# EAGLE design balise émettrice (EAGLE 6.3)
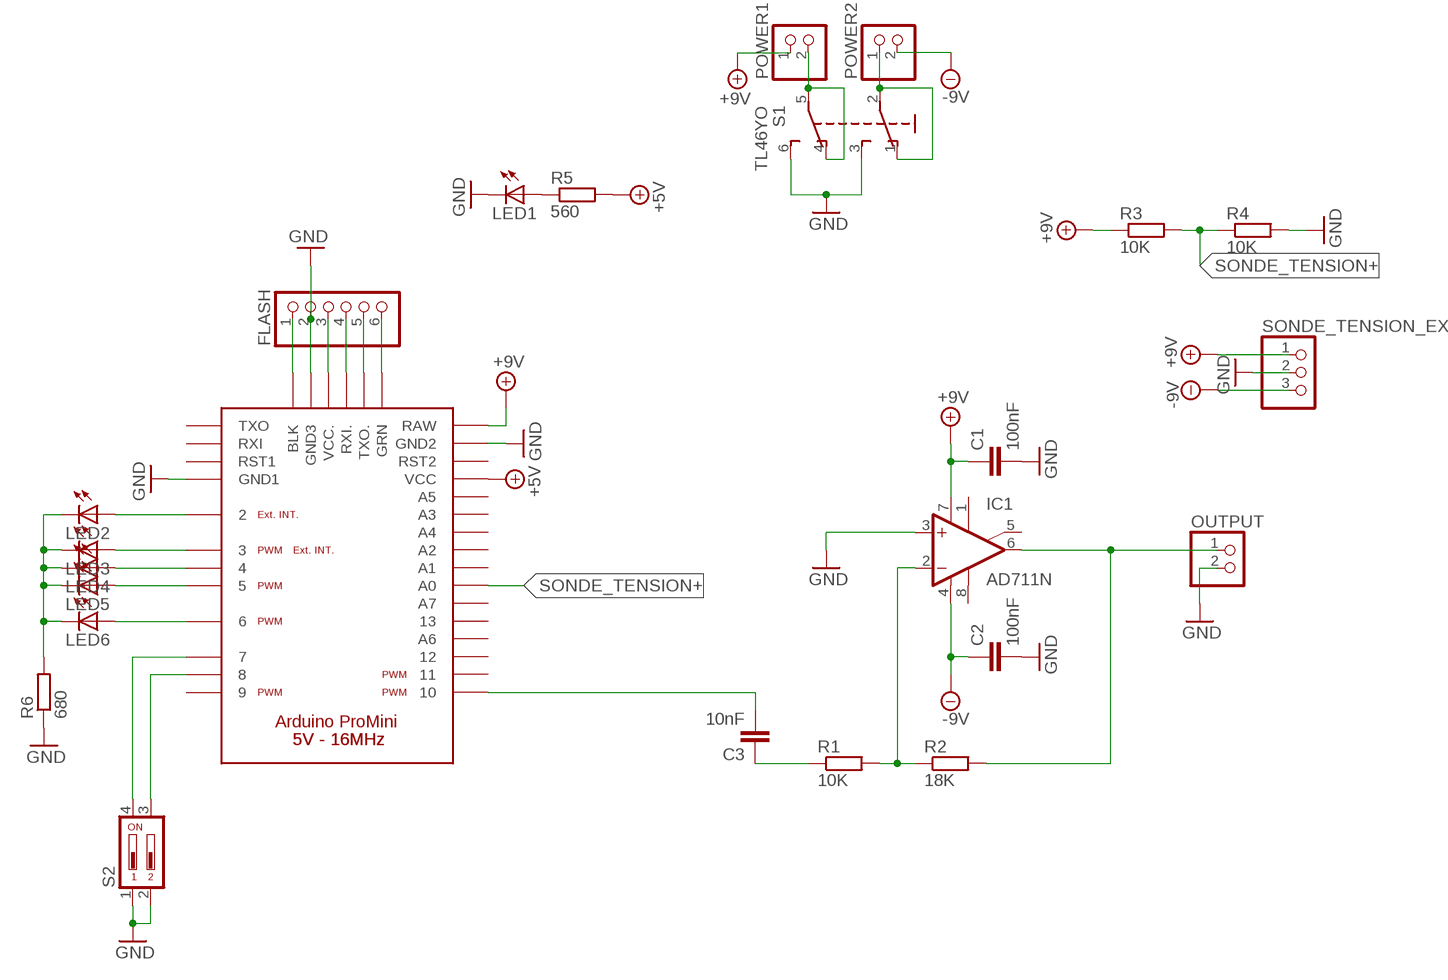
[diagram p0: schematic, sheet 1]

## Parts
C1  100nF  C-EU050-024X044  [C050-024X044]
C2  100nF  C-EU050-024X044  [C050-024X044]
C3  10nF  C-EU050-024X044  [C050-024X044]
FLASH  PINHD-1X6/90  [1X06/90]
IC1  AD711N  [DIL08]
LED1  LEDB155  [Q62902-B155]
LED2  LED3MM  [LED3MM]
LED3  LED3MM  [LED3MM]
LED4  LED3MM  [LED3MM]
LED5  LED3MM  [LED3MM]
LED6  LED3MM  [LED3MM]
OUTPUT  PINHD-1X2  [1X02]
POWER1  PINHD-1X2  [1X02]
POWER2  PINHD-1X2  [1X02]
R1  10K  R-EU_0204/7  [0204/7]
R2  18K  R-EU_0204/7  [0204/7]
R3  10K  R-EU_0204/7  [0204/7]
R4  10K  R-EU_0204/7  [0204/7]
R5  560  R-EU_0207/12  [0207/12]
R6  680  R-EU_0204/7  [0204/7]
S1  TL46YO  [TL4XYO]
S2  DA02  [DA-02]
SONDE_TENSION_EXT  PINHD-1X3  [1X03]
U$1  ARDUINO_PRO_MINI  [ARDUINO_PRO_MINI]

## Nets
+5V: R5.2 U$1.VCC1(VCC)
+9V: C1.1 IC1.7(V+) POWER1.1 R3.1 SONDE_TENSION_EXT.1 U$1.RAW
-9V: C2.1 IC1.4(V-) POWER2.2 SONDE_TENSION_EXT.3
GND: C1.2 C2.2 FLASH.2 IC1.3(+IN) LED1.K(C) OUTPUT.2 R4.2 R6.1 S1.3(S) S1.6(S1) S2.1 S2.2 SONDE_TENSION_EXT.2 U$1.GND1 U$1.GND2 U$1.GND3
N$1: FLASH.1 U$1.BLK
N$2: IC1.6(OUT) OUTPUT.1 R2.2
N$3: IC1.2(-IN) R1.2 R2.1
N$4: LED1.A R5.1
N$5: FLASH.3 U$1.VCC2(VCC.)
N$6: FLASH.4 U$1.RXI2(RXI.)
N$7: FLASH.5 U$1.TXO2(TXO.)
N$8: FLASH.6 U$1.GRN
N$9: C3.1 R1.1
N$10: LED2.A U$1.2
N$11: LED3.A U$1.3
N$12: LED4.A U$1.4
N$13: LED5.A U$1.5
N$14: LED6.A U$1.6
N$15: LED2.K(C) LED3.K(C) LED4.K(C) LED5.K(C) LED6.K(C) R6.2
N$16: POWER1.2 S1.4(O1) S1.5(P1)
N$17: POWER2.1 S1.1(O) S1.2(P)
N$20: S2.4 U$1.7
N$21: S2.3 U$1.8
N$22: C3.2 U$1.10
SONDE_TENSION+: R3.2 R4.1 U$1.A0
Unconnected: IC1.1(ON1) IC1.5(ON2) IC1.8(OPT) U$1.9 U$1.11 U$1.12 U$1.13 U$1.A1 U$1.A2 U$1.A3 U$1.A4 U$1.A5 U$1.A6 U$1.A7 U$1.RST1 U$1.RST2 U$1.RXI1(RXI) U$1.TXO1(TXO)

## Library data of the parts
C1-C3 = resistor:C-EU: CAPACITOR, European symbol
FLASH = pinhead:PINHD-1X6: PIN HEADER
IC1 = linear:AD711: OP AMP
LED1-LED6 = led:LED: LED OSRAM: - CHIPLED LG R971, LG N971, LY N971, LG Q971, LY Q971, LO R971, LY R971 LH N974, LH R974 LS Q976, LO Q976, LY Q976 LO Q996 - Hyper CHIPLED LW Q18S LB Q993, LB Q99A, LB R99A - SideLED LS A670, LO A670, LY A670, LG A670, LP A670 LB A673, LV A673, LT A673, LW A673 LH A674 LY A675 LS A676, LA A676, LO A676, LY A676, LW A676 LS A679, LY A679, LG A679 - Hyper Micro SIDELED® LS Y876, LA Y876, LO Y876, LY Y876 LT Y87S - SmartLED LW L88C, LW L88S LB L89C, LB L89S, LG L890 LS L89K, LO L89K, LY L89K LS L896, LA L896, LO L896, LY L896 - TOPLED LS T670, LO T670, LY T670, LG T670, LP T670 LSG T670, LSP T670, LSY T670, LOP T670, LYG T670 LG T671, LOG T671, LSG T671 LB T673, LV T673, LT T673, LW T673 LH T674 LS T676, LA T676, LO T676, LY T676, LB T676, LH T676, LSB T676, LW T676 LB T67C, LV T67C, LT T67C, LS T67K, LO T67K, LY T67K, LW E67C LS E67B, LA E67B, LO E67B, LY E67B, LB E67C, LV E67C, LT E67C LW T67C LS T679, LY T679, LG T679 LS T770, LO T770, LY T770, LG T770, LP T770 LB T773, LV T773, LT T773, LW T773 LH T774 LS E675, LA E675, LY E675, LS T675 LS T776, LA T776, LO T776, LY T776, LB T776 LHGB T686 LT T68C, LB T68C - Hyper Mini TOPLED® LB M676 - Mini TOPLED Santana® LG M470 LS M47K, LO M47K, LY M47K Source: http://www.osram.convergy.de LUXEON: - LUMILED® LXK2-PW12-R00, LXK2-PW12-S00, LXK2-PW14-U00, LXK2-PW14-V00 LXK2-PM12-R00, LXK2-PM12-S00, LXK2-PM14-U00 LXK2-PE12-Q00, LXK2-PE12-R00, LXK2-PE12-S00, LXK2-PE14-T00, LXK2-PE14-U00 LXK2-PB12-K00, LXK2-PB12-L00, LXK2-PB12-M00, LXK2-PB14-N00, LXK2-PB14-P00, LXK2-PB14-Q00 LXK2-PR12-L00, LXK2-PR12-M00, LXK2-PR14-Q00, LXK2-PR14-R00 LXK2-PD12-Q00, LXK2-PD12-R00, LXK2-PD12-S00 LXK2-PH12-R00, LXK2-PH12-S00 LXK2-PL12-P00, LXK2-PL12-Q00, LXK2-PL12-R00 Source: www.luxeon.com KINGBRIGHT: KA-3528ASYC Source: www.kingbright.com
OUTPUT POWER1 POWER2 = pinhead:PINHD-1X2: PIN HEADER
R1-R6 = resistor:R-EU_: RESISTOR, European symbol
S1 = switch:TL46YO: TINY SWITCH ON - ON Source: http://www2.produktinfo.conrad.com/datenblaetter/700000-724999/705152-da-01-de-Subminiaturschalter_TL_36YO.pdf
S2 = switch-dil:DA02: DIL/CODE SWITCH; OC_FARNELL: 1255229; OC_NEWARK: unknown
SONDE_TENSION_EXT = pinhead:PINHD-1X3: PIN HEADER
U$1 = arduino:ARDUINO_PRO_MINI

## Board
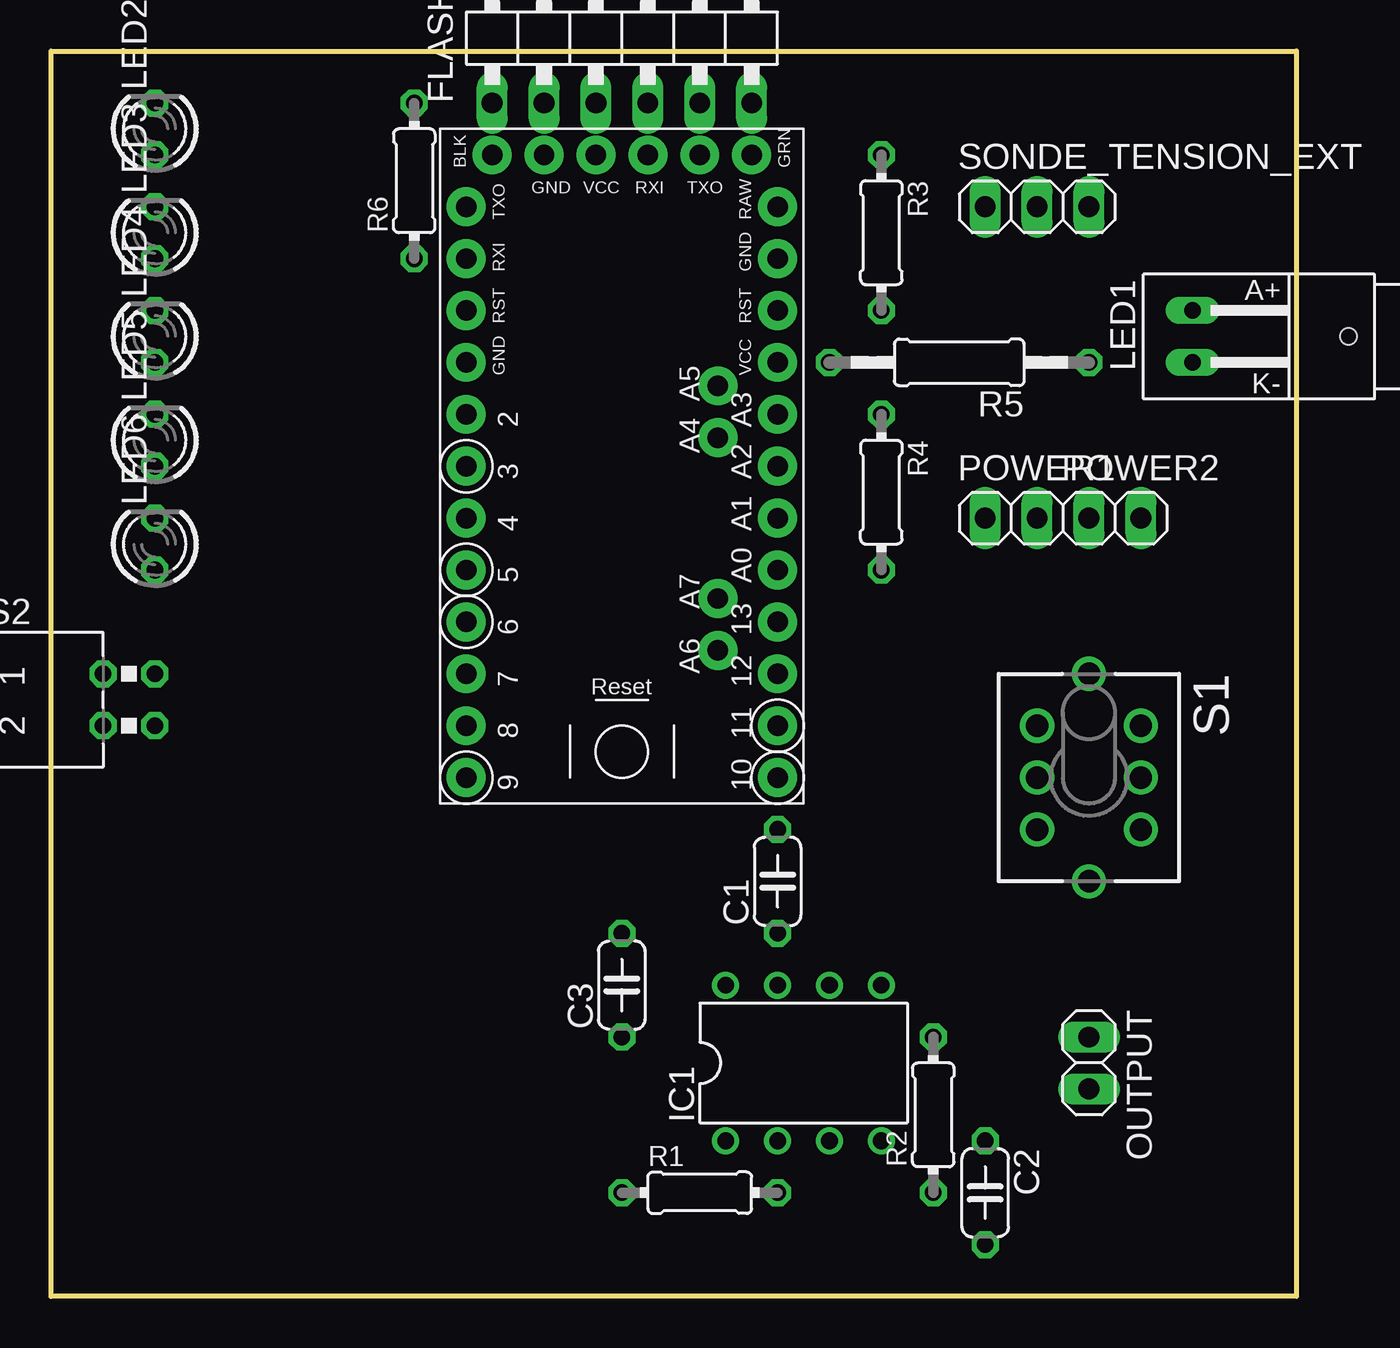
[diagram p1: board, top side]
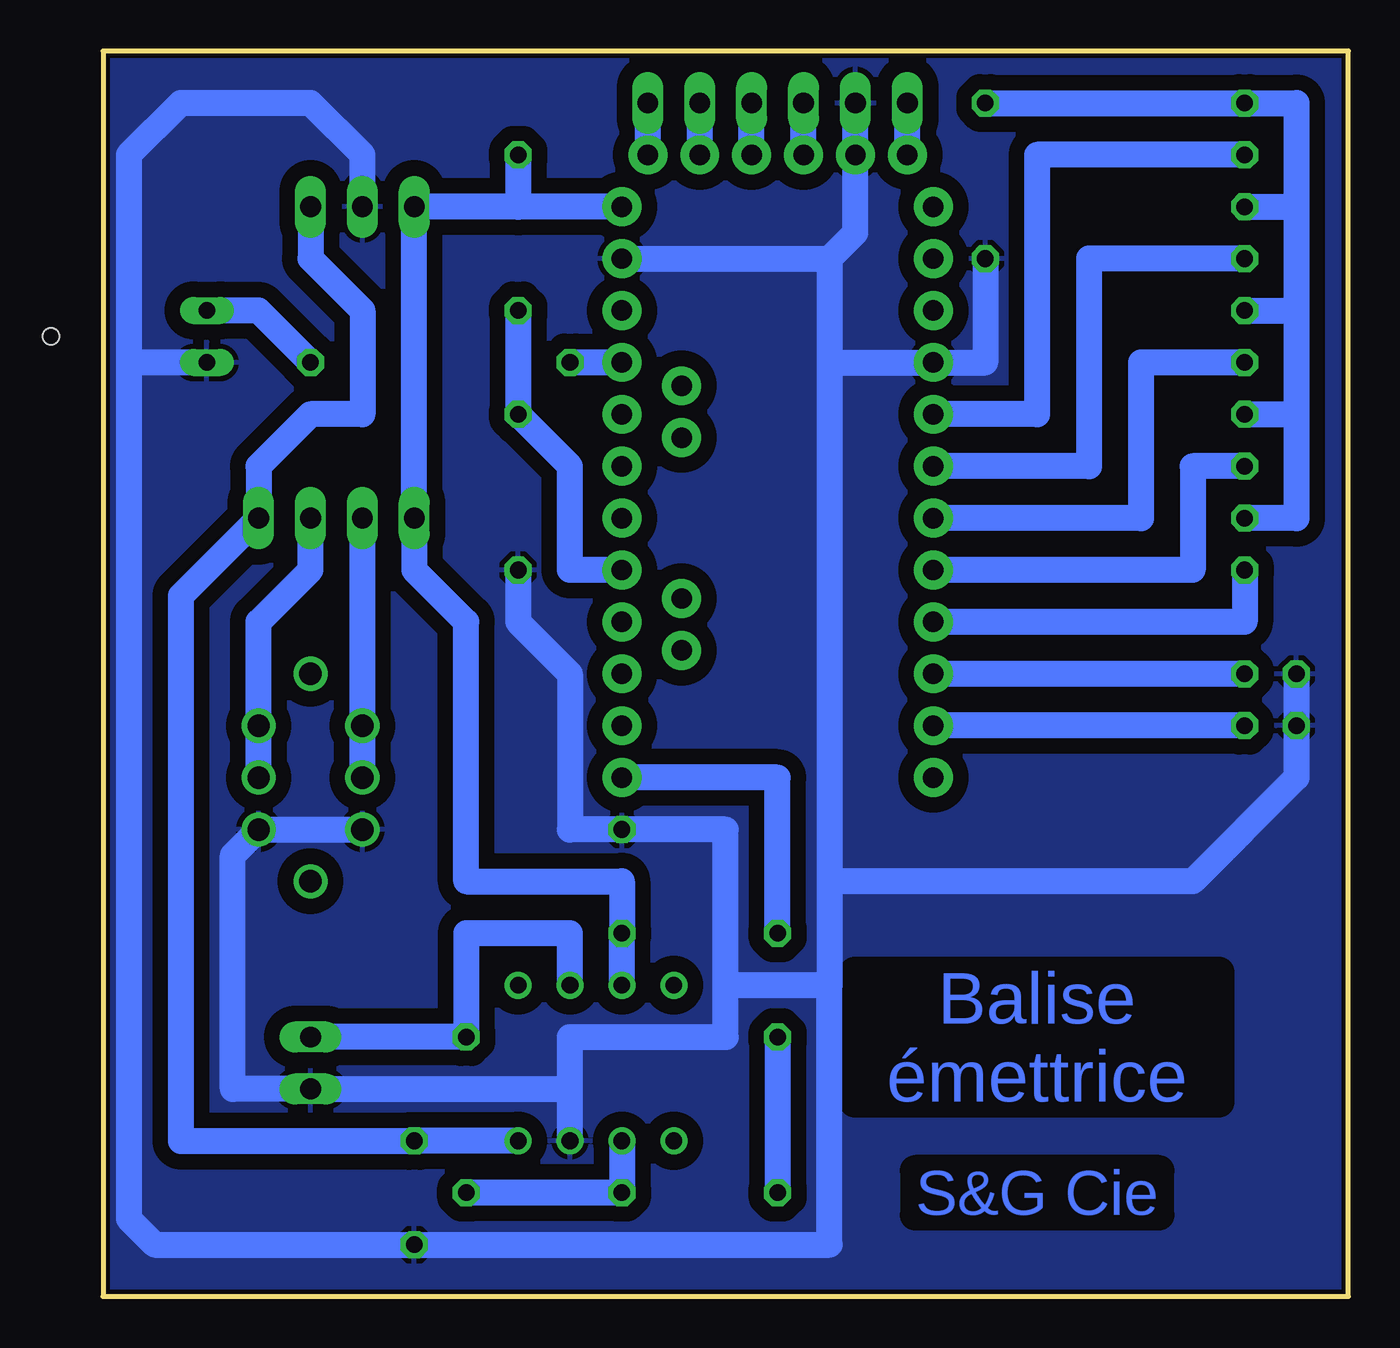
[diagram p2: board, bottom side, seen from below]

Size 60.96 x 60.96 mm. Coordinates in mm from the lower left corner, seen from the top.
Outline: 0,0 0,60.96 60.96,60.96 60.96,0 0,0
Copper layers (1*16): Top 0.035mm / dielectric 1.5mm / Bottom 0.035mm
Design rules "default *": minimum track width 10mil, minimum drill 24mil, track to track 30mil, track to pad 30mil, pad to pad 20mil, via to via 30mil, smd to smd 20mil, copper to edge 8mil, drill to drill 8mil, minimum pad ring 10mil, minimum via ring 8mil, stop-mask expansion 4mil, vias tented up to drill 0mil, thermal gap 10mil

### Footprints (pad centres in the part's own frame; a part is rotated, then mirrored left to right if it is on the bottom)
C050-024X044 = drill 0.813 octagon: 1 -2.54,0; 2 2.54,0
1X06/90 = drill 1.016 long: 1 -6.35,-3.81; 2 -3.81,-3.81; 3 -1.27,-3.81; 4 1.27,-3.81; 5 3.81,-3.81; 6 6.35,-3.81
DIL08 = drill 0.813 pad 1.27: 1 -3.81,-3.81; 2 -1.27,-3.81; 3 1.27,-3.81; 4 3.81,-3.81; 5 3.81,3.81; 6 1.27,3.81; 7 -1.27,3.81; 8 -3.81,3.81
Q62902-B155 = drill 0.813 long: A 7.62,-1.27; K 7.62,1.27 | hole 0.813: 0,0
LED3MM = drill 0.813 octagon: A -1.27,0; K 1.27,0
1X02 = drill 1.016 long: 1 -1.27,0; 2 1.27,0
0204/7 = drill 0.813 octagon: 1 -3.81,0; 2 3.81,0
0207/12 = drill 0.813 octagon: 1 -6.35,0; 2 6.35,0
TL4XYO = drill 1.1 pad 1.676: 1 -2.54,2.54; 2 0,2.54; 3 2.54,2.54; 4 -2.54,-2.54; 5 0,-2.54; 6 2.54,-2.54; M1 -5.08,0; M2 5.08,0
DA-02 = drill 0.813 octagon: 1 -1.27,-1.27; 2 1.27,-1.27; 3 1.27,1.27; 4 -1.27,1.27
1X03 = drill 1.016 long: 1 -2.54,0; 2 0,0; 3 2.54,0
ARDUINO_PRO_MINI = drill 1 pad 1.9: 2 -7.62,2.54; 3 -7.62,0; 4 -7.62,-2.54; 5 -7.62,-5.08; 6 -7.62,-7.62; 7 -7.62,-10.16; 8 -7.62,-12.7; 9 -7.62,-15.24; 10 7.62,-15.24; 11 7.62,-12.7; 12 7.62,-10.16; 13 7.62,-7.62; A0 7.62,-5.08; A1 7.62,-2.54; A2 7.62,0; A3 7.62,2.54; A4 4.699,1.397; A5 4.699,3.937; A6 4.699,-9.017; A7 4.699,-6.477; BLK -6.35,15.24; GND1 -7.62,5.08; GND2 7.62,10.16; GND3 -3.81,15.24; GRN 6.35,15.24; RAW 7.62,12.7; RST1 -7.62,7.62; RST2 7.62,7.62; RXI1 -7.62,10.16; RXI2 1.27,15.24; TXO1 -7.62,12.7; TXO2 3.81,15.24; VCC1 7.62,5.08; VCC2 -1.27,15.24

### Placement (x,y rotation side)
C1  35.56,20.32 90 top
C2  45.72,5.08 270 top
C3  27.94,15.24 90 top
FLASH  27.94,62.23 0 top
IC1  36.83,11.43 0 top
LED1  63.5,46.99 180 top
LED2  5.08,57.15 90 top
LED3  5.08,52.07 90 top
LED4  5.08,46.99 90 top
LED5  5.08,41.91 90 top
LED6  5.08,36.83 90 top
OUTPUT  50.8,11.43 270 top
POWER1  46.99,38.1 0 top
POWER2  52.07,38.1 0 top
R1  31.75,5.08 0 top
R2  43.18,8.89 90 top
R3  40.64,52.07 270 top
R4  40.64,39.37 270 top
R5  44.45,45.72 180 top
R6  17.78,54.61 90 top
S1  50.8,25.4 270 top
S2  3.81,29.21 270 top
SONDE_TENSION_EXT  48.26,53.34 0 top
U$1  27.94,40.64 0 top

### Tracks (layer width: path | path; a pad name or v marks a point on that pad's centre or on a via)
+5V
  Bottom 1.27: U$1.VCC1 R5.2
+9V
  Bottom 1.27: U$1.RAW 40.64,53.34 | 40.64,53.34 SONDE_TENSION_EXT.1 POWER1.1 45.72,35.56 43.18,33.02 43.18,20.32 35.56,20.32 C1.1 IC1.7 | R3.1 40.64,53.34
-9V
  Bottom 1.27: SONDE_TENSION_EXT.3 50.8,50.8 48.26,48.26 48.26,43.18 50.8,43.18 53.34,40.64 POWER2.2 57.15,34.29 57.15,7.62 C2.1 IC1.4
GND
  Bottom 1.27: R6.1 17.78,45.72 U$1.GND1 25.4,45.72 | FLASH.2 U$1.GND3 24.13,52.07 25.4,50.8 | SONDE_TENSION_EXT.2 48.26,55.88 50.8,58.42 57.15,58.42 59.69,55.88 59.69,45.72 | 59.69,45.72 59.69,3.81 58.42,2.54 C2.2 25.4,2.54 25.4,15.24 | LED1.K 59.69,45.72 | R4.2 40.64,33.02 38.1,30.48 38.1,22.86 C1.2 30.48,22.86 30.48,15.24 | 30.48,15.24 30.48,12.7 38.1,12.7 38.1,10.16 | S1.6 S1.3 54.61,21.59 54.61,10.16 OUTPUT.2 38.1,10.16 | S2.1 S2.2 2.54,25.4 7.62,20.32 25.4,20.32 | 25.4,15.24 30.48,15.24 | 25.4,50.8 25.4,45.72 | U$1.GND2 25.4,50.8 | 25.4,45.72 25.4,20.32 | 25.4,20.32 25.4,15.24 | IC1.3 38.1,10.16
  pour Bottom: 0,60.96 0,0 60.96,0 60.96,60.96
N$1
  Bottom 1.27: U$1.BLK FLASH.1
N$2
  Bottom 1.27: OUTPUT.1 R2.2 43.18,17.78 38.1,17.78 IC1.6
N$3
  Bottom 1.27: R2.1 R1.2 IC1.2
N$4
  Bottom 1.27: R5.1 53.34,48.26 LED1.A
N$5
  Bottom 1.27: U$1.VCC2 FLASH.3
N$6
  Bottom 1.27: U$1.RXI2 FLASH.4
N$7
  Bottom 1.27: U$1.TXO2 FLASH.5
N$8
  Bottom 1.27: U$1.GRN FLASH.6
N$9
  Bottom 1.27: C3.1 R1.1
N$10
  Bottom 1.27: LED2.A 15.24,55.88 15.24,43.18 U$1.2
N$11
  Bottom 1.27: LED3.A 12.7,50.8 12.7,40.64 U$1.3
N$12
  Bottom 1.27: LED4.A 10.16,45.72 10.16,38.1 U$1.4
N$13
  Bottom 1.27: LED5.A 7.62,40.64 7.62,35.56 U$1.5
N$14
  Bottom 1.27: LED6.A 5.08,33.02 U$1.6
N$15
  Bottom 1.27: R6.2 LED2.K 2.54,58.42 2.54,53.34 | 2.54,53.34 2.54,48.26 | 2.54,48.26 2.54,43.18 | 2.54,43.18 2.54,38.1 LED6.K | LED5.K 2.54,43.18 | LED4.K 2.54,48.26 | LED3.K 2.54,53.34
N$16
  Bottom 1.27: S1.5 S1.4 POWER1.2
N$17
  Bottom 1.27: S1.2 S1.1 53.34,33.02 50.8,35.56 POWER2.1
N$20
  Bottom 1.27: S2.4 U$1.7
N$21
  Bottom 1.27: S2.3 U$1.8
N$22
  Bottom 1.27: U$1.10 27.94,25.4 C3.2
SONDE_TENSION+
  Bottom 1.27: R3.2 R4.1 38.1,40.64 38.1,35.56 U$1.A0

### Text on the board
Bottom: Balise / émettrice | S&G Cie